# Altium schematic sheet hid.SchDoc
size A
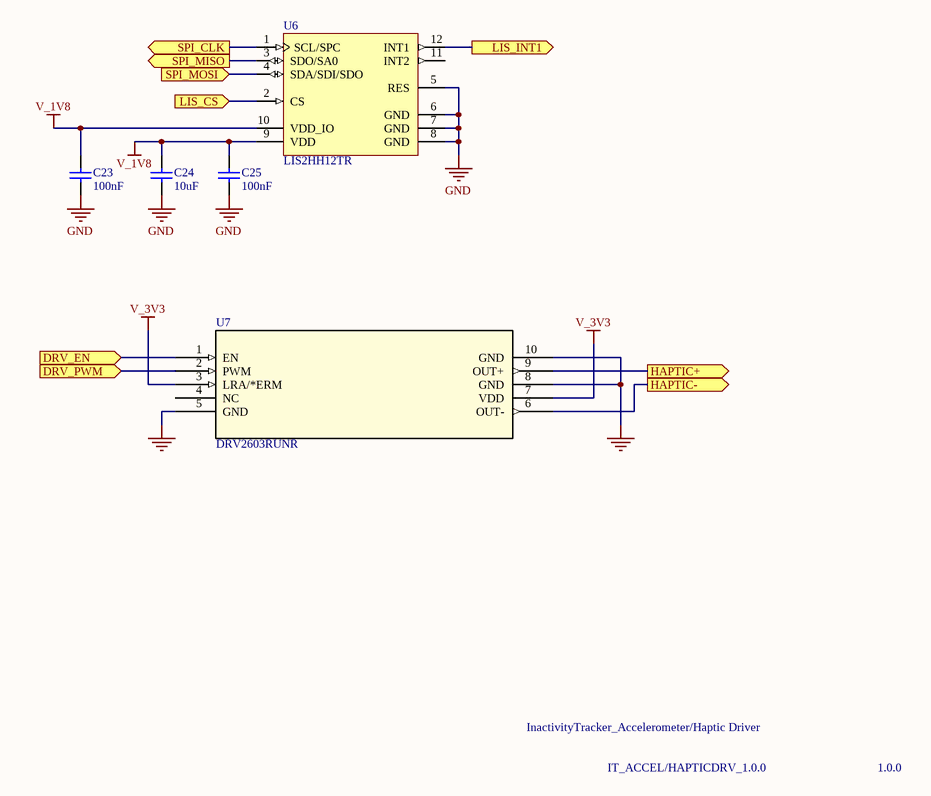
[diagram p0: hid.SchDoc]

## Parts
C23  100nF  [CAPC1005X55X25NL05T10]
C24  10uF  [CAPC1005X55X25NL05T10]
C25  100nF  [CAPC1005X55X25NL05T10]
U6  LIS2HH12TR  [STM-LGA-12]
U7  DRV2603RUNR  [RUN10]

## Ports
DRV_EN (in), DRV_PWM (in), HAPTIC+ (out), HAPTIC- (out), LIS_CS (in), LIS_INT1 (out), SPI_CLK (out), SPI_MISO (out), SPI_MOSI (in)

## Nets
GND: C23.1 C24.2 C25.1 U6.5(RES) U6.6(GND) U6.7(GND) U6.8(GND) U7.5(GND) U7.8(GND) U7.10(GND)
V_1V8: C23.2 C24.1 C25.2 U6.9(VDD) U6.10(VDD_IO)
V_3V3: U7.3(LRA/*ERM) U7.7(VDD)
DRV_EN: U7.1(EN) ; port DRV_EN
DRV_PWM: U7.2(PWM) ; port DRV_PWM
HAPTIC+: U7.9(OUT+) ; port HAPTIC+
HAPTIC-: U7.6(OUT-) ; port HAPTIC-
LIS_CS: U6.2(CS) ; port LIS_CS
LIS_INT1: U6.12(INT1) ; port LIS_INT1
SPI_CLK: U6.1(SCL/SPC) ; port SPI_CLK
SPI_MISO: U6.3(SDO/SA0) ; port SPI_MISO
SPI_MOSI: U6.4(SDA/SDI/SDO) ; port SPI_MOSI

Not connected (* = marked no-connect by the designer): U6 11(INT2); U7 4(NC)

## Notes on the sheet
- InactivityTracker_Accelerometer/Haptic Driver
- IT_ACCEL/HAPTICDRV_1.0.0
- 1.0.0

## Library data of the parts
C23 C25 = CMP-2008-04639-1: Part Number: GRM155R71H104KE14D; Manufacturer: Murata
C24 = CMP-2008-04556-1: Part Number: GRM155R61A105KE15D; Manufacturer: Murata
U6 = CMP-2000-07462-1: MEMS Digital Output Motion Sensor: Ultra-Low-Power High-Performance 3-Axis "Pico" Accelerometer, 1.71 to 3.6 V, -40 to 85 degC, 12-Pin LGA, RoHS, Tape and Reel; Manufacturer: STMicroelectronics; Bandwidth: 400Hz; Package Description: 12-Pin Land Grid Array Package, Body 2 x 2 mm, Pitch 0.5 mm; Manufacturer URL: http://www.st.com/; Lead Free: LeadFree; Case\/Package: LGA; RoHSCompliant: true; Min Operating Temperature: -40degC; Mounting Technology: SurfaceMount; Packaging: TapeandReel; Max Operating Temperature: 85degC; Mount: SurfaceMount; Number of Pins: 12; Datasheet URL: http://www.st.com/content/ccc/resource/technical/document/datasheet/c9/16/f2/79/ca/31/47/89/DM00096789.pdf/files/DM00096789.pdf/jcr:content/translations/en.DM00096789.pdf; Contact Plating: Gold; Package Reference: LGA-12; Datasheet Version: Rev. 5, 12/2015
U7 = DRV2603RUNR: Motor Driver Power MOSFET Parallel, PWM 10-QFN (2x2); Vendor: Texas Instruments; Built_By: EMA_UL_Team; Manufacturer_Part_Number: DRV2603RUNR; Copyright: Copyright (C) 2018 Accelerated Designs. All rights reserved; RefDes: RefDes; Type: DEV; Value: Value